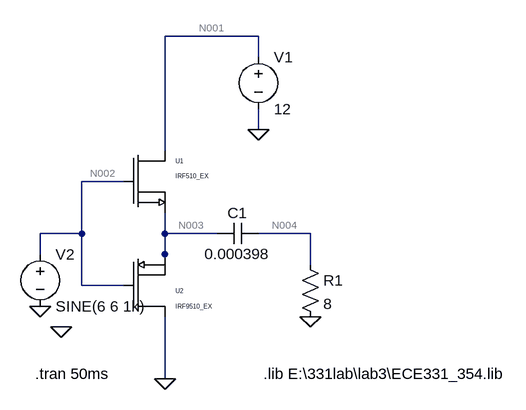
[diagram p0: schematic lab3_1.asc]
lab3_1.asc, the LTspice schematic file:
Version 4
SHEET 1 880 680
WIRE 272 -96 128 -96
WIRE 272 -64 272 -96
WIRE 272 48 272 16
WIRE 128 80 128 -96
WIRE 64 128 0 128
WIRE 0 208 0 128
WIRE 0 208 -64 208
WIRE 128 208 128 176
WIRE 208 208 128 208
WIRE 352 208 272 208
WIRE -64 240 -64 208
WIRE 128 240 128 208
WIRE 128 256 128 240
WIRE 352 256 352 208
WIRE 0 288 0 208
WIRE 64 288 0 288
WIRE 128 432 128 336
FLAG 272 48 0
FLAG 128 432 0
FLAG 352 336 0
FLAG -64 320 0
FLAG -32 352 0
SYMBOL IRF510 64 80 R0
SYMATTR InstName U1
SYMBOL IRF9510 64 240 R0
SYMATTR InstName U2
SYMBOL voltage 272 -80 R0
WINDOW 123 0 0 Left 2
WINDOW 39 0 0 Left 2
SYMATTR InstName V1
SYMATTR Value 12
SYMBOL cap 272 192 R90
WINDOW 0 0 32 VBottom 2
WINDOW 3 32 32 VTop 2
SYMATTR InstName C1
SYMATTR Value 0.000398
SYMBOL res 336 240 R0
SYMATTR InstName R1
SYMATTR Value 8
SYMBOL voltage -64 224 R0
WINDOW 123 0 0 Left 2
WINDOW 39 0 0 Left 2
SYMATTR InstName V2
SYMATTR Value SINE(6 6 1k)
TEXT -72 424 Left 2 !.tran 50ms
TEXT 280 424 Left 2 !.lib E:\\331lab\\lab3\\ECE331_354.lib

The netlist it stands for:
* lab3_1.asc
XU1 N001 N002 N003 IRF510_EX  ; pins D G S
XU2 0 N002 N003 IRF9510_EX  ; pins D G S
V1 N001 0 12
C1 N004 N003 0.000398
R1 N004 0 8
V2 N002 0 SINE(6 6 1k)
.tran 50ms
.lib E:\331lab\lab3\ECE331_354.lib
.backanno
.end

* Results of the author's LTspice run, read from the files saved beside the schematic
* Operating Point, zero values left out:
*   V(n003) = 2.15 V
*   V(n001) = 12 V
*   V(n002) = 6 V
*   I(V1) = -635.1 µA
*   Ix(u1:1) = 635.1 µA
*   Ix(u1:2) = -6 pA
*   Ix(u1:3) = -635.1 µA
*   Ix(u2:1) = -635.1 µA
*   Ix(u2:2) = 6 pA
*   Ix(u2:3) = 635.1 µA
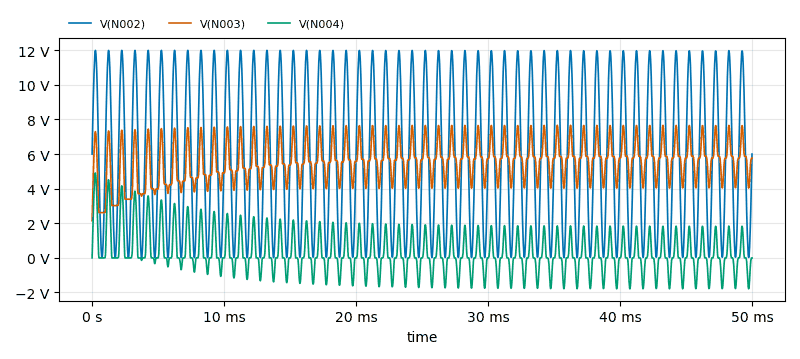
[diagram p1: Transient Analysis of lab3_1.asc, plotted from the saved traces]
* Transient Analysis, 1 run:
*   V(N002): min 5.475 mV, max 12 V, average 6.006 V, rms 7.338 V, last 6 V
*   V(N003): min 2.15 V, max 7.66 V, average 5.564 V, rms 5.684 V, last 5.765 V
*   V(N004): min -1.791 V, max 4.905 V, average 230.9 mV, rms 1.171 V, last -4.997 mV